# EAGLE design PhoneVibrator-Breakout (EAGLE 7.4.0)
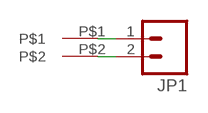
[diagram p0: schematic, sheet 1]

## Parts
JP1  M02PTH  [1X02]
U$1  PHONE_VIBRATOR  [PHONE_VIBRATOR]

## Nets
N$1: JP1.1 U$1.P$1
N$2: JP1.2 U$1.P$2

## Library data of the parts
JP1 = SparkFun-Connectors:M02: Standard 2-pin 0.1" header. Use with - straight break away headers ( PRT-00116) - right angle break away headers (PRT-00553) - swiss pins (PRT-00743) - machine pins (PRT-00117) - female headers (PRT-00115) Molex polarized connector foot print use with: PRT-08233 with associated crimp pins and housings. 2.54_SCREWTERM for use with PRT-10571. 3.5mm Screw Terminal footprints for PRT-08084 5mm Screw Terminal footprints for use with PRT-08432
U$1 = HokieGeek:PHONE_VIBRATOR

## Board
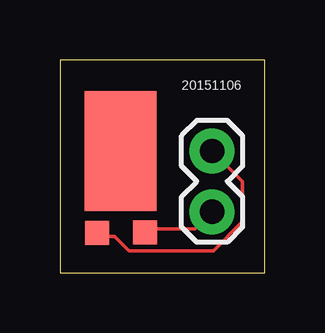
[diagram p1: board, top side]
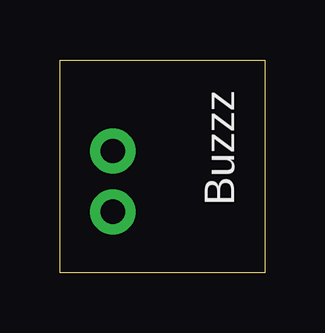
[diagram p2: board, bottom side, seen from below]

Size 8.56 x 8.88 mm. Coordinates in mm from the lower left corner, seen from the top.
Outline: 0,0 8.56,0 8.56,8.88 0,8.88 0,0
Copper layers (1*16): Top 0.0356mm / dielectric 1.5011mm / Bottom 0.0356mm
Design rules "LaenPCBOrder": minimum track width 6mil, minimum drill 13mil, track to track 6mil, track to pad 6mil, pad to pad 6mil, via to via 6mil, smd to smd 6mil, copper to edge 15mil, drill to drill 6mil, minimum pad ring 7mil, minimum via ring 7mil, stop-mask expansion 3mil, vias tented up to drill 0mil, thermal gap 10mil

### Footprints (pad centres in the part's own frame; a part is rotated, then mirrored left to right if it is on the bottom)
1X02 = drill 1.016 pad 1.88: 1 0,0; 2 2.54,0
PHONE_VIBRATOR = smd 1 x 1: P$1 -0.997,-0.889; P$2 1.005,-0.857 | smd 3 x 5: P$3 0,2.54

### Placement (x,y rotation side)
JP1  6.35,5.08 270 top
U$1  2.54,2.54 0 top

### Tracks (layer width: path | path; a pad name or v marks a point on that pad's centre or on a via)
N$1
  Top 0.152: JP1.1 7.62,3.81 7.62,2.13 6.4,0.91 2.9,0.91 2.29,1.52 1.68,1.52 U$1.P$1
N$2
  Top 0.152: JP1.2 5.64,1.83 3.66,1.83 U$1.P$2

### Text on the board
tPlace: 20151106
bPlace: Buzzz